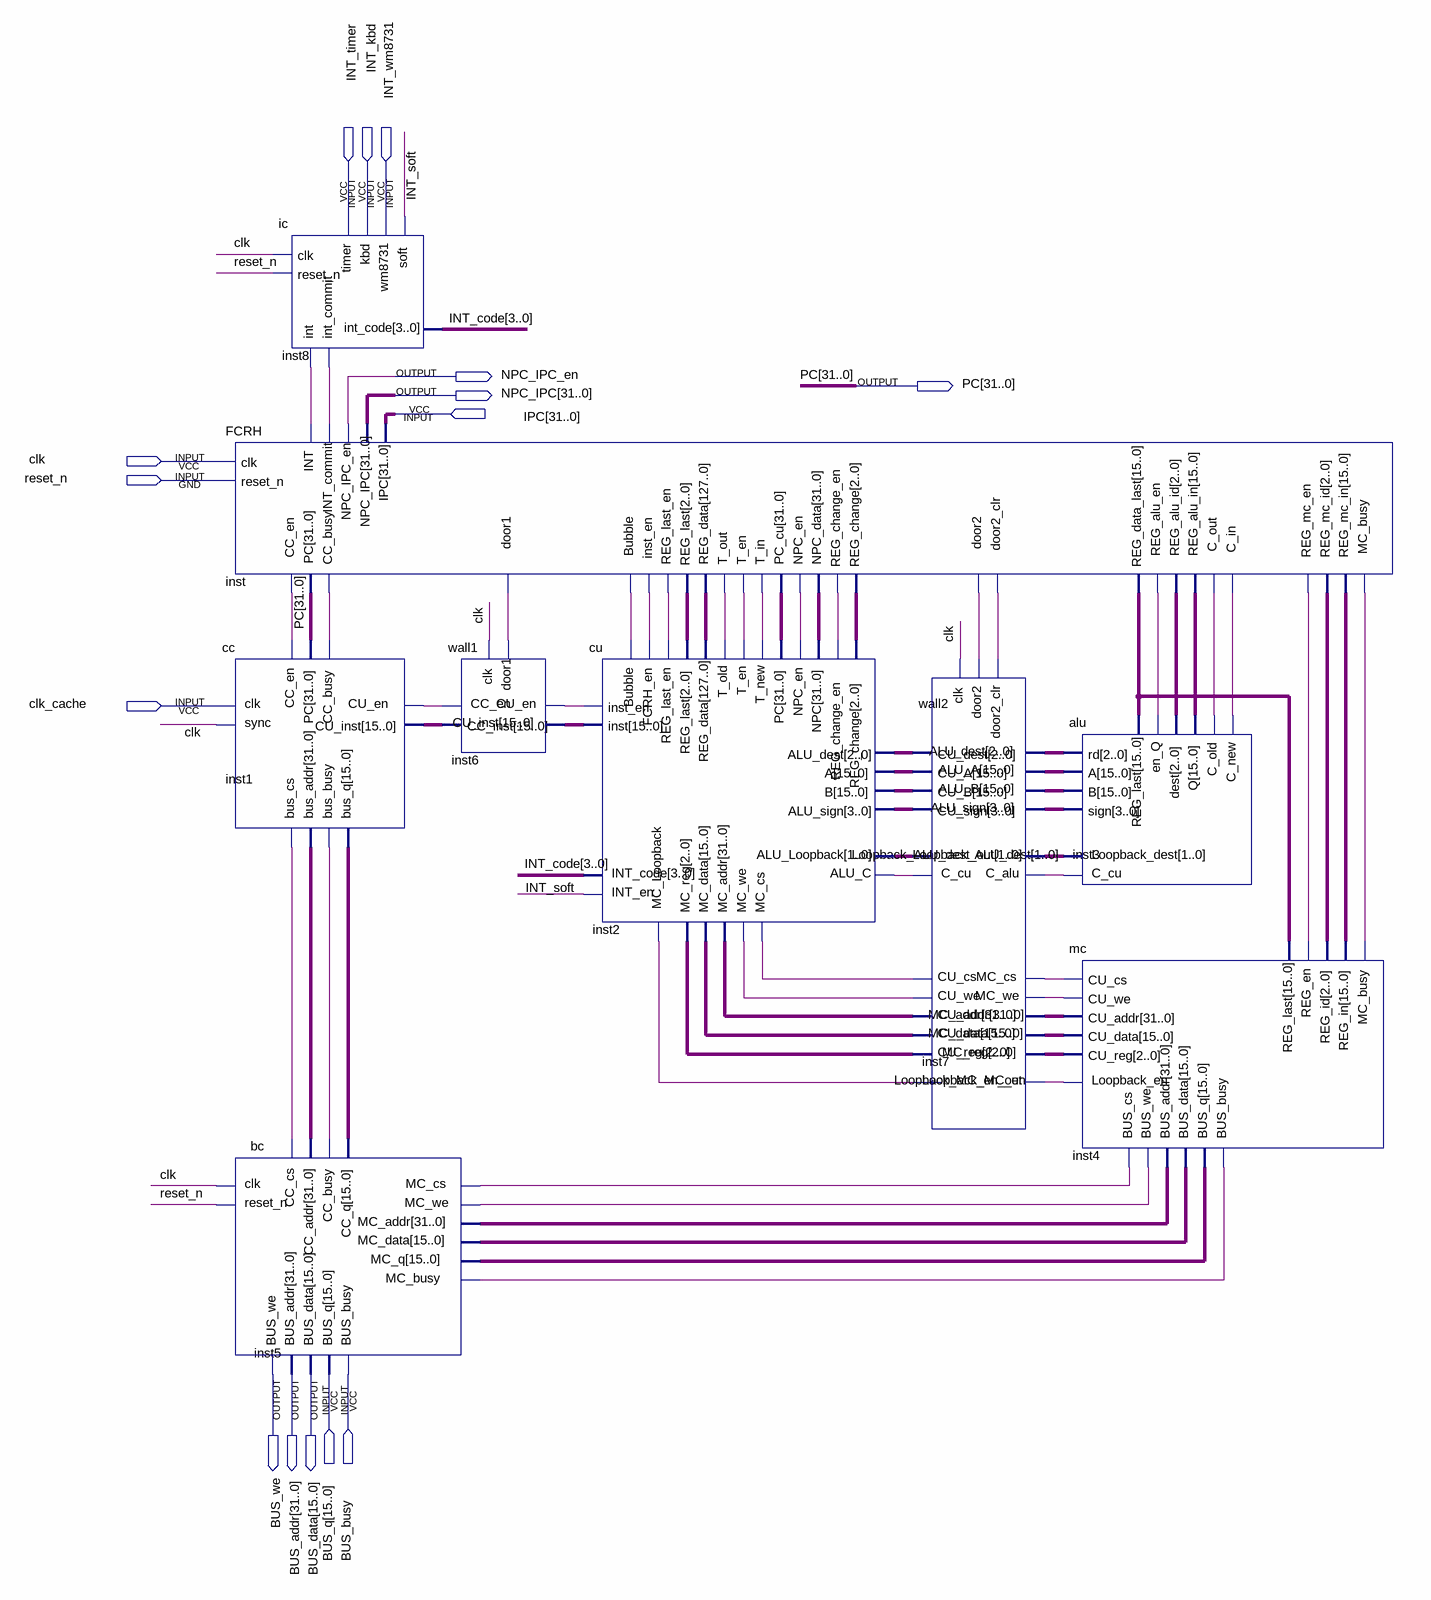
[diagram p0: schematic sheet]
// Quartus schematic CPU.bdf as structural Verilog: 9 symbols, 15 pins
module CPU (
  input  INT_timer,
  input  INT_kbd,
  input  INT_wm8731,
  input  [31:0] IPC,
  input  clk,
  input  reset_n,
  input  clk_cache,
  input  [15:0] BUS_q,
  input  BUS_busy,
  output NPC_IPC_en,
  output [31:0] PC,
  output [31:0] NPC_IPC,
  output BUS_we,
  output [31:0] BUS_addr,
  output [15:0] BUS_data
);

  wire inst1_bus_cs, inst1_cc_busy, inst1_cu_en, inst2_bubble, inst2_mc_cs, inst2_mc_loopback, inst2_mc_we,
       inst2_npc_en, inst2_reg_change_en, inst2_t_en, inst2_t_new, inst3_c_cu, inst3_c_new, inst3_en_q,
       inst4_bus_cs, inst4_bus_we, inst4_mc_busy, inst4_reg_en, inst5_cc_busy, inst5_mc_busy, inst6_cu_en,
       inst7_c_cu, inst7_loopback_mc_en_out, inst7_mc_cs, inst7_mc_we, inst8_int, inst_c_out, inst_cc_en,
       inst_door1, inst_door2, inst_door2_clr, inst_inst_en, inst_int_commit, inst_reg_last_en, inst_t_out,
       INT_soft;
  wire [1:0] inst2_alu_loopback, inst7_loopback_alu_dest_out;
  wire [2:0] inst2_alu_dest, inst2_mc_reg, inst2_reg_change, inst3_dest, inst4_reg_id, inst7_alu_dest,
       inst7_mc_reg, inst_reg_last;
  wire [3:0] inst2_alu_sign, inst7_alu_sign, INT_code;
  wire [15:0] inst1_cu_inst, inst2_a, inst2_b, inst2_mc_data, inst3_q, inst4_bus_data, inst4_reg_in,
       inst5_cc_q, inst5_mc_q, inst6_cu_inst, inst7_alu_a, inst7_alu_b, inst7_mc_data, inst_reg_data_last;
  wire [31:0] inst1_bus_addr, inst2_mc_addr, inst2_npc, inst4_bus_addr, inst7_mc_addr, inst_pc_cu;
  wire [127:0] inst_reg_data;

  FCRH inst (
    .clk(clk), .CC_busy(inst1_cc_busy), .NPC_en(inst2_npc_en), .T_en(inst2_t_en), .T_in(inst2_t_new),
    .REG_alu_id(inst3_dest), .REG_alu_in(inst3_q), .REG_alu_en(inst3_en_q), .REG_mc_id(inst4_reg_id),
    .REG_mc_in(inst4_reg_in), .REG_mc_en(inst4_reg_en), .Bubble(inst2_bubble), .NPC_data(inst2_npc),
    .MC_busy(inst4_mc_busy), .REG_change(inst2_reg_change), .REG_change_en(inst2_reg_change_en),
    .C_in(inst3_c_new), .IPC(IPC), .reset_n(reset_n), .INT(inst8_int), .T_out(inst_t_out),
    .REG_data(inst_reg_data), .CC_en(inst_cc_en), .PC_cu(inst_pc_cu), .PC(PC), .REG_last(inst_reg_last),
    .REG_last_en(inst_reg_last_en), .inst_en(inst_inst_en), .C_out(inst_c_out), .NPC_IPC(NPC_IPC),
    .NPC_IPC_en(NPC_IPC_en), .door2(inst_door2), .door1(inst_door1), .door2_clr(inst_door2_clr),
    .REG_data_last(inst_reg_data_last), .INT_commit(inst_int_commit));
  cc inst1 (
    .bus_q(inst5_cc_q), .bus_busy(inst5_cc_busy), .clk(clk_cache), .sync(clk), .CC_en(inst_cc_en), .PC(PC),
    .CU_inst(inst1_cu_inst), .bus_cs(inst1_bus_cs), .bus_addr(inst1_bus_addr), .CU_en(inst1_cu_en),
    .CC_busy(inst1_cc_busy));
  bc inst5 (
    .MC_cs(inst4_bus_cs), .MC_we(inst4_bus_we), .MC_data(inst4_bus_data), .MC_addr(inst4_bus_addr),
    .CC_cs(inst1_bus_cs), .CC_addr(inst1_bus_addr), .BUS_q(BUS_q), .BUS_busy(BUS_busy), .clk(clk),
    .reset_n(reset_n), .MC_q(inst5_mc_q), .MC_busy(inst5_mc_busy), .CC_q(inst5_cc_q),
    .CC_busy(inst5_cc_busy), .BUS_we(BUS_we), .BUS_addr(BUS_addr), .BUS_data(BUS_data));
  ic inst8 (
    .clk(clk), .reset_n(reset_n), .timer(INT_timer), .kbd(INT_kbd), .wm8731(INT_wm8731), .\soft (INT_soft),
    .int_commit(inst_int_commit), .\int (inst8_int), .int_code(INT_code));
  wall1 inst6 (
    .clk(clk), .CC_inst(inst1_cu_inst), .CC_en(inst1_cu_en), .door1(inst_door1), .CU_en(inst6_cu_en),
    .CU_inst(inst6_cu_inst));
  cu inst2 (
    .inst_en(inst6_cu_en), .inst(inst6_cu_inst), .REG_data(inst_reg_data), .T_old(inst_t_out),
    .PC(inst_pc_cu), .FCRH_en(inst_inst_en), .REG_last_en(inst_reg_last_en), .REG_last(inst_reg_last),
    .INT_code(INT_code), .ALU_C(inst7_c_cu), .NPC_en(inst2_npc_en), .T_new(inst2_t_new), .T_en(inst2_t_en),
    .A(inst2_a), .B(inst2_b), .MC_cs(inst2_mc_cs), .MC_we(inst2_mc_we), .MC_reg(inst2_mc_reg),
    .MC_addr(inst2_mc_addr), .MC_data(inst2_mc_data), .REG_change_en(inst2_reg_change_en),
    .REG_change(inst2_reg_change), .NPC(inst2_npc), .INT_en(INT_soft), .Bubble(inst2_bubble),
    .ALU_dest(inst2_alu_dest), .ALU_sign(inst2_alu_sign), .ALU_Loopback(inst2_alu_loopback),
    .MC_Loopback(inst2_mc_loopback));
  wall2 inst7 (
    .clk(clk), .CU_dest(inst2_alu_dest), .CU_A(inst2_a), .CU_B(inst2_b), .CU_sign(inst2_alu_sign),
    .CU_reg(inst2_mc_reg), .CU_data(inst2_mc_data), .CU_addr(inst2_mc_addr), .CU_we(inst2_mc_we),
    .CU_cs(inst2_mc_cs), .door2(inst_door2), .Loopback_ALU_dest(inst2_alu_loopback),
    .Loopback_MC_en(inst2_mc_loopback), .C_alu(inst3_c_cu), .door2_clr(inst_door2_clr),
    .ALU_dest(inst7_alu_dest), .ALU_A(inst7_alu_a), .ALU_B(inst7_alu_b), .ALU_sign(inst7_alu_sign),
    .MC_reg(inst7_mc_reg), .MC_data(inst7_mc_data), .MC_addr(inst7_mc_addr), .MC_we(inst7_mc_we),
    .MC_cs(inst7_mc_cs), .Loopback_ALU_dest_out(inst7_loopback_alu_dest_out),
    .Loopback_MC_en_out(inst7_loopback_mc_en_out), .C_cu(inst7_c_cu));
  alu inst3 (
    .rd(inst7_alu_dest), .A(inst7_alu_a), .B(inst7_alu_b), .sign(inst7_alu_sign),
    .REG_last(inst_reg_data_last), .Loopback_dest(inst7_loopback_alu_dest_out), .C_old(inst_c_out),
    .dest(inst3_dest), .Q(inst3_q), .en_Q(inst3_en_q), .C_new(inst3_c_new), .C_cu(inst3_c_cu));
  mc inst4 (
    .CU_cs(inst7_mc_cs), .CU_we(inst7_mc_we), .CU_reg(inst7_mc_reg), .CU_addr(inst7_mc_addr),
    .CU_data(inst7_mc_data), .BUS_busy(inst5_mc_busy), .BUS_q(inst5_mc_q), .REG_last(inst_reg_data_last),
    .Loopback_en(inst7_loopback_mc_en_out), .BUS_cs(inst4_bus_cs), .BUS_we(inst4_bus_we),
    .BUS_addr(inst4_bus_addr), .BUS_data(inst4_bus_data), .REG_id(inst4_reg_id), .REG_in(inst4_reg_in),
    .REG_en(inst4_reg_en), .MC_busy(inst4_mc_busy));
endmodule
